# Altium schematic sheet Misc.SchDoc
size A; SheetNumber: 2; SheetTotal: 7
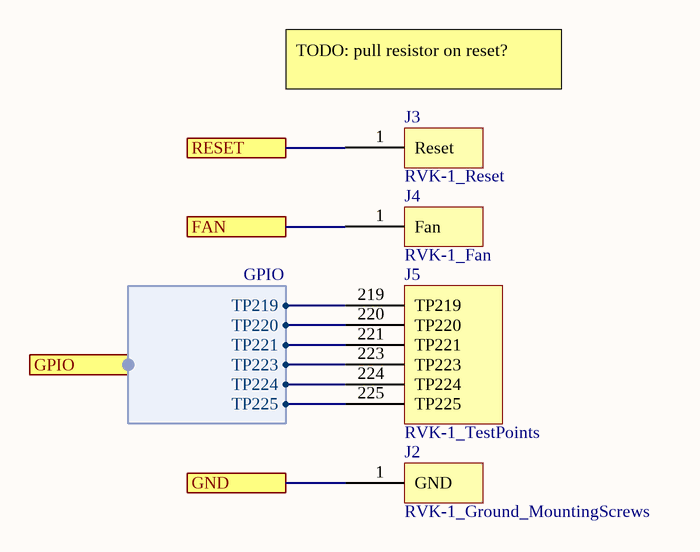
[diagram p0: Misc.SchDoc]

## Parts
J2  RVK-1_Ground_MountingScrews  [RVK-1_GND_Screws - LMAO with extra screwpost]
J3  RVK-1_Reset  [RVK-1_Reset]
J4  RVK-1_Fan  [RVK-1_Fan_PWM]
J5  RVK-1_TestPoints  [RVK-1_TestPoint_Vias]

## Ports
FAN, GND, GPIO (harness GPIO), RESET

## Harnesses
GPIO: TP219, TP220, TP221, TP223, TP224, TP225

## Nets
FAN: J4.1(Fan) ; port FAN
GND: J2.1(GND) ; port GND
RESET: J3.1(Reset) ; port RESET
NetJ5_219: J5.219(TP219) ; port GPIO.TP219
NetJ5_220: J5.220(TP220) ; port GPIO.TP220
NetJ5_221: J5.221(TP221) ; port GPIO.TP221
NetJ5_223: J5.223(TP223) ; port GPIO.TP223
NetJ5_224: J5.224(TP224) ; port GPIO.TP224
NetJ5_225: J5.225(TP225) ; port GPIO.TP225

## Notes on the sheet
- (near J3) TODO: pull resistor on reset?